# EAGLE design Moisture_sensor (EAGLE 9.5.1)
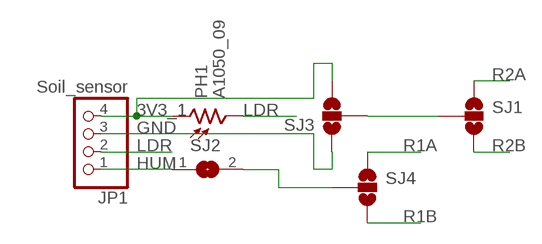
[diagram p0: schematic, sheet 1]

## Parts
JP1  Soil_sensor  PINHD-1X4  [1X04]
PH1  A1050_09  [T0-46-A10XX]
SJ1  SOLDERJUMPER_2WAYS  [SJ_3]
SJ2  SJ  [SJ]
SJ3  SOLDERJUMPER_2WAYS  [SJ_3]
SJ4  SOLDERJUMPER_2WAYS  [SJ_3]

## Nets
3V3_1: JP1.4 PH1.1 SJ3.3
GND: JP1.3 SJ3.1
HUM: JP1.1 SJ2.1
LDR: JP1.2 PH1.2
N$1: SJ2.2 SJ4.2
N$2: SJ1.2 SJ3.2
R1A: SJ4.1
R1B: SJ4.3
R2A: SJ1.1
R2B: SJ1.3

## Library data of the parts
JP1 = pinhead:PINHD-1X4: PIN HEADER
PH1 = photo-elements:A10: Sensor Robust Light Sensing Applications Outdoor Light Sensing Application Source: http://optoelectronics.perkinelmer.com/content/Datasheets/DTS_PhotocellsA1050.pdf
SJ1 SJ3 SJ4 = SparkFun:SOLDERJUMPER_2WAY: Solder Jumper 2 way solder jumper
SJ2 = jumper:SJ: SMD solder JUMPER

## Board
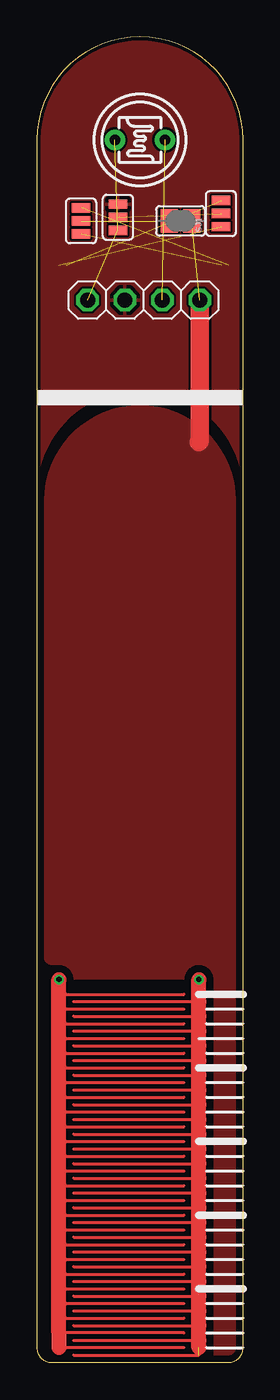
[diagram p1: board, top side]
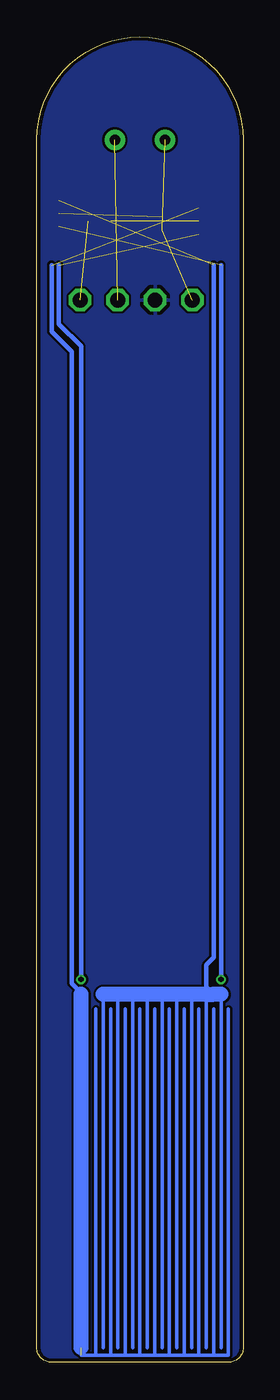
[diagram p2: board, bottom side, seen from below]

Size 14 x 90 mm. Coordinates in mm from the lower left corner, seen from the top.
Outline: 0,1 arc90 1,0 13,0 arc90 14,1 14,83 arc90 7,90 arc90 0,83 0,1
Copper layers (1*16): Top 0.035mm / dielectric 1.5mm / Bottom 0.035mm
Design rules "SeeedStudio_2layer_DRU_no_angle_20140221 *": minimum track width 6mil, minimum drill 12mil, track to track 6mil, track to pad 6mil, pad to pad 6mil, via to via 6mil, smd to smd 1mil, copper to edge 10mil, drill to drill 10mil, minimum pad ring 10mil, minimum via ring 6mil, stop-mask expansion 2mil, vias tented up to drill 100mil, thermal gap 10mil

### Footprints (pad centres in the part's own frame; a part is rotated, then mirrored left to right if it is on the bottom)
1X04 = drill 1.016 octagon: 1 -3.81,0; 2 -1.27,0; 3 1.27,0; 4 3.81,0
T0-46-A10XX = drill 0.7 pad 1.4: 1 -1.7,0; 2 1.7,0
SJ_3 = smd 0.635 x 1.27: 1 -0.889,0; 2 0,0; 3 0.889,0
SJ = smd 1.168 x 1.6: 1 -0.762,0; 2 0.762,0

### Placement (x,y rotation side)
JP1  7.25,72.12 180 top
PH1  7,83 0 top
SJ1  12.5,78 90 top
SJ2  9.75,77.5 180 top
SJ3  5.5,77.75 270 top
SJ4  3,77.5 90 top

### Tracks (layer width: path | path; a pad name or v marks a point on that pad's centre or on a via)
3V3_1  (2 unrouted)
GND
  pour Bottom: 0,83 arc-90 7,90 arc-90 14,83 14,1 arc-90 13,0 1,0 arc-90 0,1
  pour Top: 7,66 arc90 0,59 0,83 arc-90 7,90 arc-90 14,83 14,59 arc90
HUM  (1 unrouted)
  Top 1.27: JP1.1 11.06,62.56 11,62.5
  pour Top: 7,65 arc90 0.5,58.5 0.5,27.5 arc90 1,27 1.5,27 arc-90 2.5,26 10,26 arc-90 11,27 arc-90 12,26 12,0.5 13,0.5 arc90 13.5,1 13.5,58.5 arc90
LDR  (1 unrouted)
N$1  (1 unrouted)
N$2  (1 unrouted)
R1A  (via drill 0.35)  (2 unrouted)
  Top 0.2: 2.5,3.5 11,3.5 | 2.5,2.5 11,2.5 | 2.5,1.5 11,1.5 | 2.5,4.5 11,4.5 | 2.5,5.5 11,5.5 | 2.5,6.5 11,6.5 | 2.5,7.5 11,7.5 | 2.5,8.5 11,8.5 | 2.5,9.5 11,9.5 | 2.5,10.5 11,10.5 | 2.5,11.5 11,11.5 | 2.5,12.5 11,12.5 | 2.5,13.5 11,13.5 | 2.5,14.5 11,14.5 | 2.5,15.5 11,15.5 | 2.5,16.5 11,16.5 | 2.5,17.5 11,17.5 | 2.5,18.5 11,18.5 | 2.5,19.5 11,19.5 | 2.5,20.5 11,20.5 | 2.5,21.5 11,21.5 | 2.5,22.5 11,22.5 | 2.5,23.5 11,23.5 | 2.5,24.5 11,24.5 | 2.5,0.5 11,0.5
  Top 1.016: 11,1 11,1.5 11,2.5 11,3.5 11,4.5 11,5.5 11,6.5 11,7.5 11,8.5 11,9.5 11,10.5 11,11.5 11,12.5 11,13.5 11,14.5 11,15.5 11,16.5 11,17.5 11,18.5 11,19.5 11,20.5 11,21.5 11,22.5 11,23.5 11,24.5 v11,26
  Bottom 0.305: v11,26 11,69 12.5,70.5 12.5,74.5
R1B  (1 unrouted)
  Bottom 0.254: 11,1 11,0.5 10,0.5 | 10,0.5 9,0.5 | 9,0.5 8,0.5 | 8,0.5 7,0.5 | 7,0.5 6,0.5 | 6,0.5 5,0.5 | 5,0.5 4,0.5 | 4,0.5 3,0.5 | 3,0.5 2,0.5 | 2,0.5 1,0.5 1,24 | 2,0.5 2,24 | 3,0.5 3,24 | 4,0.5 4,24 | 5,0.5 5,24 | 6,0.5 6,24 | 7,0.5 7,24 | 8,0.5 8,24 | 9,0.5 9,24 | 10,0.5 10,24
  Bottom 0.305: 11,25 11,25.11 11.63,25.74 11.63,68.63 13,70 13,74.5
  Bottom 1.016: 11,1 11,25
R2A  (via drill 0.35)  (1 unrouted)
  Top 0.2: 10,2 1.5,2 | 1.5,3 10,3 | 1.5,4 10,4 | 10,1 1.5,1 | 1.5,5 10,5 | 1.5,6 10,6 | 1.5,7 10,7 | 1.5,8 10,8 | 1.5,9 10,9 | 1.5,10 10,10 | 1.5,11 10,11 | 1.5,12 10,12 | 1.5,13 10,13 | 1.5,14 10,14 | 1.5,15 10,15 | 1.5,16 10,16 | 1.5,17 10,17 | 1.5,18 10,18 | 1.5,19 10,19 | 1.5,25.25 1.5,25 10,25 | 1.5,20 10,20 | 1.5,21 10,21 | 1.5,22 10,22 | 1.5,23 10,23 | 1.5,24 10,24
  Top 1.016: 1.5,1 1.5,2 1.5,3 1.5,4 1.5,5 1.5,6 1.5,7 1.5,8 1.5,9 1.5,10 1.5,11 1.5,12 1.5,13 1.5,14 1.5,15 1.5,16 1.5,17 1.5,18 1.5,19 1.5,20 1.5,21 1.5,22 1.5,23 1.5,24 1.5,25 v1.5,26
  Bottom 0.305: v1.5,26 1.5,74.5
R2B  (1 unrouted)
  Bottom 0.254: 1.5,25 1.5,1 | 2.5,25 2.5,1 | 3.5,25 3.5,1 | 4.5,25 4.5,1 | 5.5,25 5.5,1 | 6.5,25 6.5,1 | 7.5,25 7.5,1 | 8.5,25 8.5,1 | 9.5,25 9.5,1
  Bottom 0.305: 2,25 2.5,25.5 2.5,27 2,27.5 2,74.5
  Bottom 1.016: 1.5,25 2,25 2.5,25 3.5,25 4.5,25 5.5,25 6.5,25 7.5,25 8.5,25 9.5,25